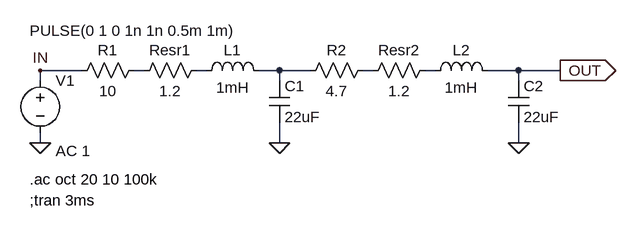
[diagram p0: schematic 4thButterWorthLPF_NoBuffer_1mH_r.asc]
4thButterWorthLPF_NoBuffer_1mH_r.asc, the LTspice schematic file:
Version 4
SHEET 1 1092 680
WIRE 16 128 -48 128
WIRE 112 128 96 128
WIRE 208 128 192 128
WIRE 320 128 288 128
WIRE 368 128 320 128
WIRE 464 128 448 128
WIRE 560 128 544 128
WIRE 688 128 640 128
WIRE 752 128 688 128
WIRE -48 144 -48 128
WIRE 320 144 320 128
WIRE 688 144 688 128
WIRE -48 240 -48 224
WIRE 320 240 320 208
WIRE 688 240 688 208
FLAG 320 240 0
FLAG -48 240 0
FLAG 752 128 OUT
IOPIN 752 128 Out
FLAG 688 240 0
FLAG -48 128 IN
SYMBOL ind 192 144 R270
WINDOW 0 32 56 VTop 2
WINDOW 3 5 56 VBottom 2
SYMATTR InstName L1
SYMATTR Value 1mH
SYMBOL res 112 112 R90
WINDOW 0 0 56 VBottom 2
WINDOW 3 32 56 VTop 2
SYMATTR InstName R1
SYMATTR Value 10
SYMBOL cap 304 144 R0
SYMATTR InstName C1
SYMATTR Value 22uF
SYMBOL voltage -48 128 R0
WINDOW 123 24 124 Left 2
WINDOW 39 0 0 Left 2
WINDOW 3 -16 -61 Left 2
SYMATTR Value2 AC 1
SYMATTR Value PULSE(0 1 0 1n 1n 0.5m 1m)
SYMATTR InstName V1
SYMBOL ind 544 144 R270
WINDOW 0 32 56 VTop 2
WINDOW 3 5 56 VBottom 2
SYMATTR InstName L2
SYMATTR Value 1mH
SYMBOL res 464 112 R90
WINDOW 0 0 56 VBottom 2
WINDOW 3 32 56 VTop 2
SYMATTR InstName R2
SYMATTR Value 4.7
SYMBOL cap 672 144 R0
SYMATTR InstName C2
SYMATTR Value 22uF
SYMBOL res 208 112 R90
WINDOW 0 0 56 VBottom 2
WINDOW 3 32 56 VTop 2
SYMATTR InstName Resr1
SYMATTR Value 1.2
SYMBOL res 560 112 R90
WINDOW 0 0 56 VBottom 2
WINDOW 3 32 56 VTop 2
SYMATTR InstName Resr2
SYMATTR Value 1.2
TEXT -64 296 Left 2 !.ac oct 20 10 100k
TEXT -64 328 Left 2 !;tran 3ms

The netlist it stands for:
* 4thButterWorthLPF_NoBuffer_1mH_r.asc
L1 N002 N003 1mH
R1 N001 IN 10
C1 N003 0 22uF
V1 IN 0 PULSE(0 1 0 1n 1n 0.5m 1m) AC 1
L2 N005 OUT 1mH
R2 N004 N003 4.7
C2 OUT 0 22uF
Resr1 N002 N001 1.2
Resr2 N005 N004 1.2
.ac oct 20 10 100k
;tran 3ms
.backanno
.end